# EAGLE design air_flow (EAGLE 9.5.2)
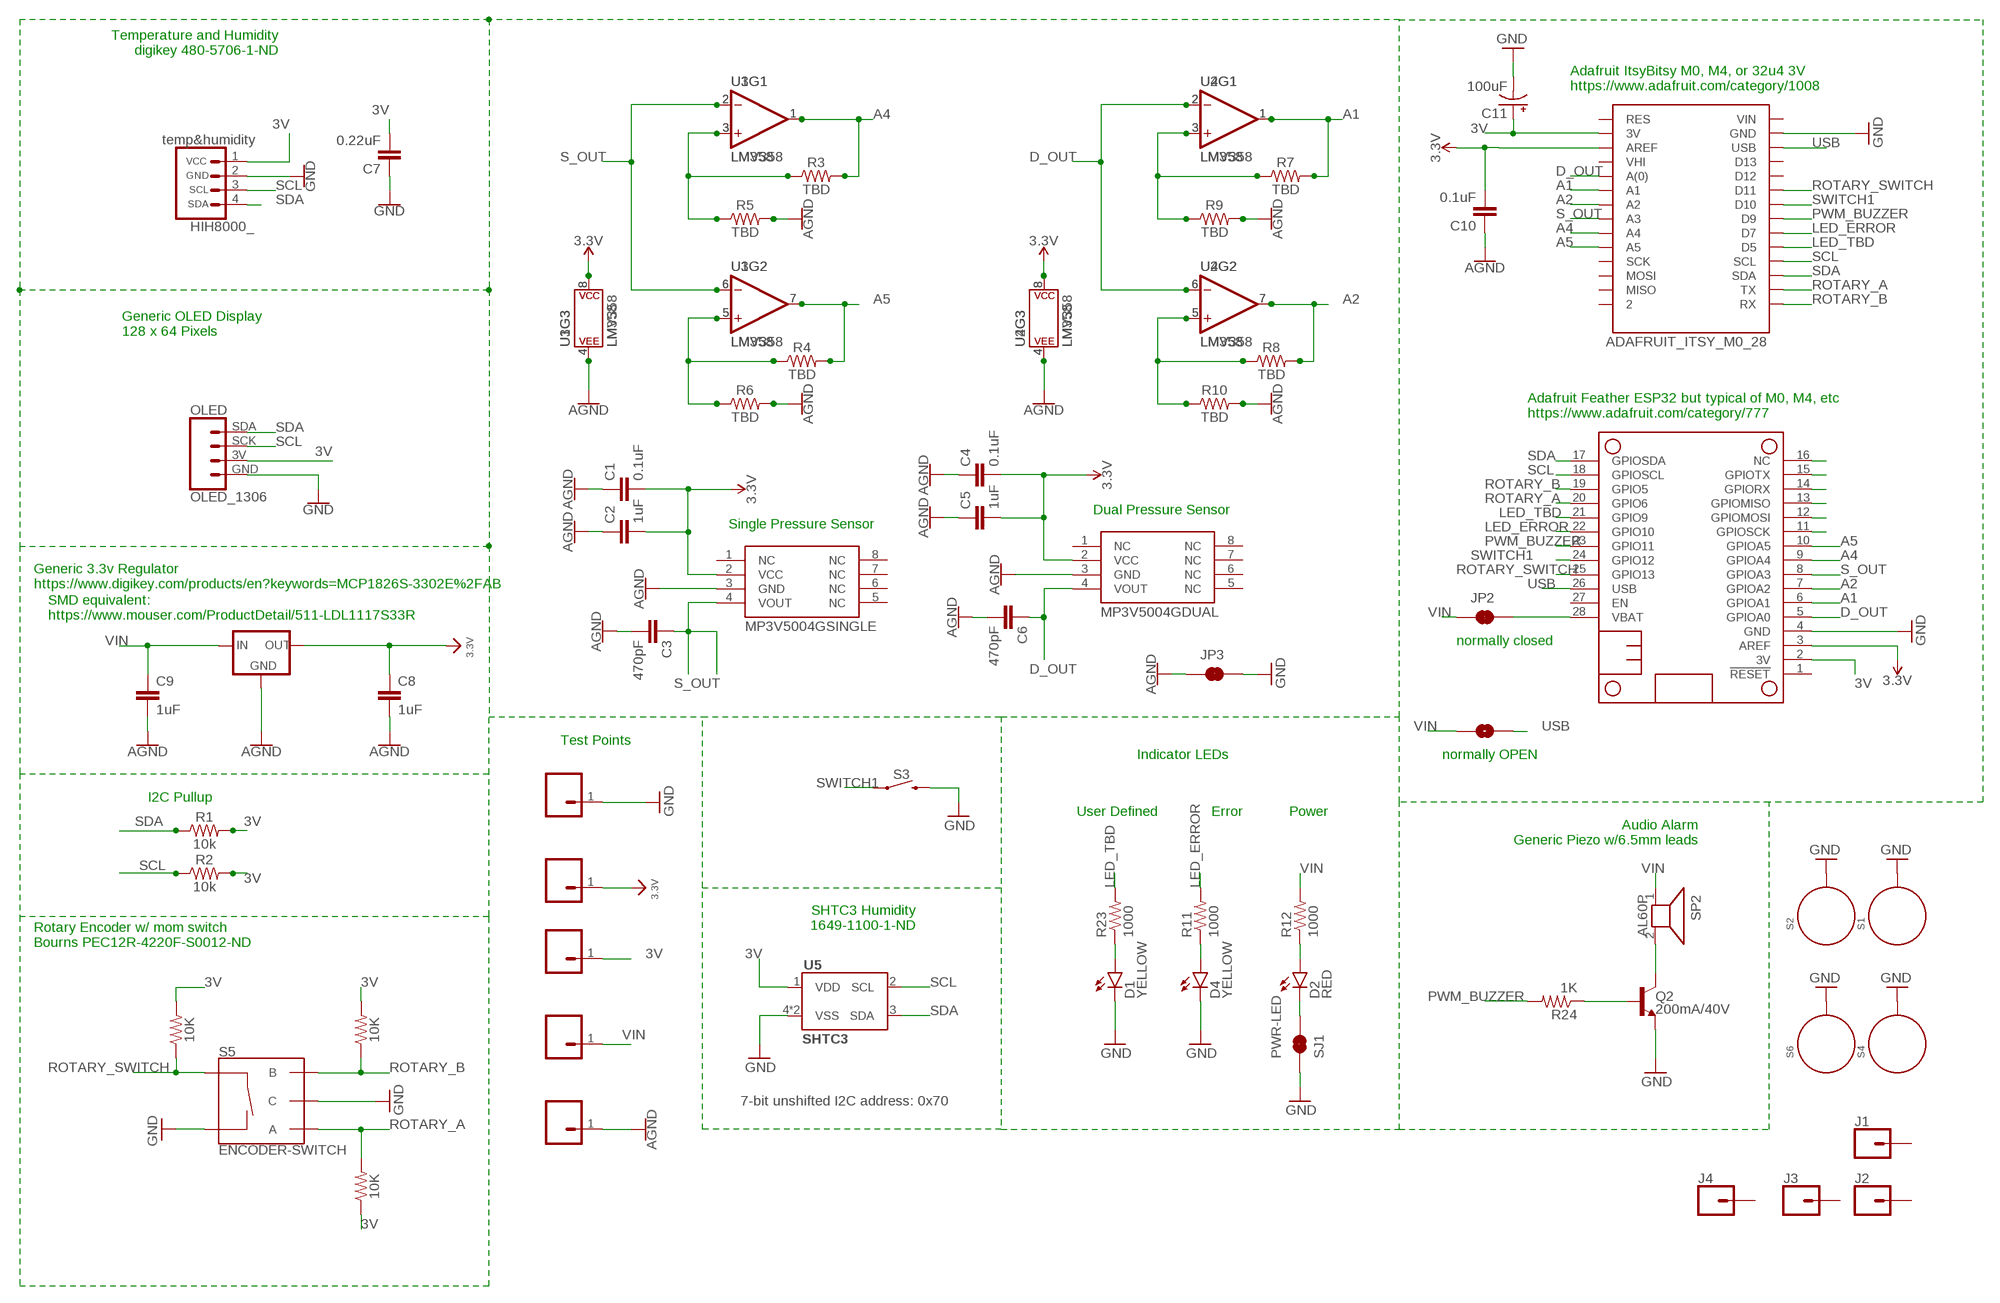
[diagram p0: schematic, sheet 1]

## Parts
3V_REGULATOR  LDL1117_5V_REG  [SOT223]
C1  0.1uF  0.1UF-KIT-EZ-50V-20%  [CAP-PTH-SMALL-KIT]
C2  1uF  0.1UF-KIT-EZ-50V-20%  [CAP-PTH-SMALL-KIT]
C3  470pF  0.1UF-KIT-EZ-50V-20%  [CAP-PTH-SMALL-KIT]
C4  0.1uF  0.1UF-KIT-EZ-50V-20%  [CAP-PTH-SMALL-KIT]
C5  1uF  0.1UF-KIT-EZ-50V-20%  [CAP-PTH-SMALL-KIT]
C6  470pF  0.1UF-KIT-EZ-50V-20%  [CAP-PTH-SMALL-KIT]
C7  0.22uF  0.1UF-KIT-EZ-50V-20%  [CAP-PTH-SMALL-KIT]
C8  1uF  0.1UF-KIT-EZ-50V-20%  [CAP-PTH-SMALL-KIT]
C9  1uF  0.1UF-KIT-EZ-50V-20%  [CAP-PTH-SMALL-KIT]
C10  0.1uF  0.1UF-KIT-EZ-50V-20%  [CAP-PTH-SMALL-KIT]
C11  100uF  100UF-POLAR-RADIAL-2.5MM-25V-20%  [CPOL-RADIAL-2.5MM-6.5MM]
D1  YELLOW  LED-YELLOWLARGE  [LED-1206]
D2  RED  LED-RED1206  [LED-1206]
D4  YELLOW  LED-YELLOWLARGE  [LED-1206]
J1  CONN_01  [1X01]
J2  CONN_01  [1X01]
J3  CONN_01  [1X01]
J4  CONN_01  [1X01]
JP1  JUMPER-SMT_2_NO_NO-SILK  [SMT-JUMPER_2_NO_NO-SILK]
JP2  JUMPER-SMT_2_NC_TRACE_SILK  [SMT-JUMPER_2_NC_TRACE_SILK]
JP3  JUMPER-SMT_2_NC_TRACE_SILK  [SMT-JUMPER_2_NC_TRACE_SILK]
MS2  FEATHERWING_NODIM  [FEATHERWING_DIM]
Q2  200mA/40V  TRANS_NPN-2N3904  [TO-92]
R1  10k  10KOHM-HORIZ-1/4W-5%  [AXIAL-0.3]
R2  10k  10KOHM-HORIZ-1/4W-5%  [AXIAL-0.3]
R3  TBD  10KOHM-HORIZ-1/4W-5%  [AXIAL-0.3]
R4  TBD  10KOHM-HORIZ-1/4W-5%  [AXIAL-0.3]
R5  TBD  10KOHM-HORIZ-1/4W-5%  [AXIAL-0.3]
R6  TBD  10KOHM-HORIZ-1/4W-5%  [AXIAL-0.3]
R7  TBD  10KOHM-HORIZ-1/4W-5%  [AXIAL-0.3]
R8  TBD  10KOHM-HORIZ-1/4W-5%  [AXIAL-0.3]
R9  TBD  10KOHM-HORIZ-1/4W-5%  [AXIAL-0.3]
R10  TBD  10KOHM-HORIZ-1/4W-5%  [AXIAL-0.3]
R11  1000  RESISTOR0805-RES  [0805]
R12  1000  RESISTOR0805-RES  [0805]
R13  0.3  0.3OHM-0805-1/8W-1%  [0805]
R14  0.3  0.3OHM-0805-1/8W-1%  [0805]
R15  0.3  0.3OHM-0805-1/8W-1%  [0805]
R16  0.3  0.3OHM-0805-1/8W-1%  [0805]
R17  0.3  0.3OHM-0805-1/8W-1%  [0805]
R18  0.3  0.3OHM-0805-1/8W-1%  [0805]
R19  0.3  0.3OHM-0805-1/8W-1%  [0805]
R20  0.3  0.3OHM-0805-1/8W-1%  [0805]
R21  0.3  0.3OHM-0805-1/8W-1%  [0805]
R22  0.3  0.3OHM-0805-1/8W-1%  [0805]
R23  1000  RESISTOR0805-RES  [0805]
R24  1K  RESISTOR0805-RES  [0805]
R26  10K  0.3OHM-0805-1/8W-1%  [0805]
R27  10K  0.3OHM-0805-1/8W-1%  [0805]
R28  10K  0.3OHM-0805-1/8W-1%  [0805]
S1  STANDOFF_ELECTRICAL5-32  [STANDOFF_ELECTRICAL_5_32]
S2  STANDOFF_ELECTRICAL5-32  [STANDOFF_ELECTRICAL_5_32]
S3  MOMENTARY-SWITCH-SPST-PTH-6.0MM-KIT  [TACTILE_SWITCH_PTH_6.0MM_KIT]
S4  STANDOFF_ELECTRICAL5-32  [STANDOFF_ELECTRICAL_5_32]
S5  ENCODER-SWITCH  [ROTARY_ENC_PLAIN]
S6  STANDOFF_ELECTRICAL5-32  [STANDOFF_ELECTRICAL_5_32]
SJ1  PWR-LED  JUMPER-PAD-2-NC_BY_TRACENO_SILK  [PAD-JUMPER-2-NC_BY_TRACE_NO_SILK]
SP2  AL60P  [AL60P]
U1  LM358  [DIP08]
U2  LM358  [DIP08]
U3  LMV358  LMV358SOIC  [SO08]
U4  LMV358  LMV358SOIC  [SO08]
U5  SHTC3  [SHTC3]
U$1  OLED_1306  [OLED_1306]
U$2  MP3V5004GSINGLE  [MP3V5004GP]
U$3  MP3V5004GDUAL  [MP3V5004DP]
U$4  HIH8000_  [HIH8120_TH]
U$20  CONN_0138MILL  [1X01-40MILL]
U$26  CONN_0138MILL  [1X01-40MILL]
U$31  CONN_0138MILL  [1X01-40MILL]
U$39  CONN_0138MILL  [1X01-40MILL]
U$40  CONN_0138MILL  [1X01-40MILL]
U$45  ADAFRUIT_ITSY_M0_28  [ADAFRUIT_ITS_MO_28]

## Nets
3.3V: 3V_REGULATOR.2(OUT) 3V_REGULATOR.4(OUT) C1.2 C2.2 C4.2 C5.2 C8.1 C10.2 MS2.3(AREF) U1.8(P$V+) U2.8(P$V+) U3.8(P$V+) U4.8(P$V+) U$2.2(VCC) U$3.2(VCC) U$39.1 U$45.AREF
3V: C7.2 C11.1(+) MS2.2(3V) R1.P$2 R2.P$2 R21.2 R22.2 R26.2 R27.1 R28.2 U5.1(VDD) U$1.3V(VCC) U$4.1(VCC) U$20.1 U$45.3V
A1: MS2.6(GPIOA1) R7.P$2 R17.2 U2.1(OUT) U4.1(OUT) U$45.A1
A2: MS2.7(GPIOA2) R8.P$2 R19.2 U2.7(OUT) U4.7(OUT) U$45.A2
A4: MS2.9(GPIOA4) R3.P$2 R16.2 U1.1(OUT) U3.1(OUT) U$45.A4
A5: MS2.10(GPIOA5) R4.P$2 R14.2 U1.7(OUT) U3.7(OUT) U$45.A5
AGND: 3V_REGULATOR.1(GND) C1.1 C2.1 C3.2 C4.1 C5.1 C6.2 C8.2 C9.2 C10.1 JP3.1 R5.P$2 R6.P$2 R9.P$2 R10.P$2 R13.2 R15.2 R18.2 R20.2 U1.4(P$V-) U2.4(P$V-) U3.4(P$V-) U4.4(P$V-) U$2.3(GND) U$3.3(GND) U$26.1
D_OUT: C6.1 MS2.5(GPIOA0) U2.2(-IN) U2.6(-IN) U4.2(-IN) U4.6(-IN) U$3.4(VOUT) U$45.A0(A(0))
GND: C7.1 C11.2(-) D1.C D4.C JP3.2 MS2.4(GND) Q2.1(E) S1.P1 S2.P1 S3.3 S4.P1 S5.C S5.SW- S6.P1 SJ1.1 U5.4(VSS) U5.5(VSS) U$1.GND U$4.2(GND) U$31.1 U$45.GND
LED_ERROR: MS2.22(GPIO10) R11.2 U$45.D7
LED_TBD: MS2.21(GPIO9) R23.2 U$45.D5
N$1: R3.P$1 R5.P$1 R13.1 R16.1 U1.3(+IN) U3.3(+IN)
N$2: D2.A R12.1
N$3: D1.A R23.1
N$5: R4.P$1 R6.P$1 R14.1 R15.1 U1.5(+IN) U3.5(+IN)
N$6: R7.P$1 R9.P$1 R17.1 R18.1 U2.3(+IN) U4.3(+IN)
N$7: MS2.16(NC)
N$8: R8.P$1 R10.P$1 R19.1 R20.1 U2.5(+IN) U4.5(+IN)
N$9: Q2.3(C) SP2.2
N$10: Q2.2(B) R24.1
N$11: D4.A R11.1
N$12: D2.C SJ1.2
N$13: MS2.15(GPIOTX)
N$14: MS2.14(GPIORX)
N$15: MS2.13(GPIOMISO)
N$16: MS2.12(GPIOMOSI)
N$17: MS2.11(GPIOSCK)
PWM_BUZZER: MS2.23(GPIO11) R24.2 U$45.D9
ROTARY_A: MS2.20(GPIO6) R27.2 S5.A U$45.TX
ROTARY_B: MS2.19(GPIO5) R26.1 S5.B U$45.RX
ROTARY_SWITCH: MS2.25(GPIO13) R28.1 S5.SW+ U$45.D11
S_OUT: C3.1 MS2.8(GPIOA3) U1.2(-IN) U1.6(-IN) U3.2(-IN) U3.6(-IN) U$2.4(VOUT) U$45.A3
SCL: MS2.18(GPIOSCL) R2.P$1 R22.1 U5.2(SCL) U$1.SCK U$4.3(SCL) U$45.SCL
SDA: MS2.17(GPIOSDA) R1.P$1 R21.1 U5.3(SDA) U$1.SDA U$4.4(SDA) U$45.SDA
SWITCH1: MS2.24(GPIO12) S3.1 U$45.D10
USB: JP1.2 MS2.26(USB) U$45.USB
VBAT: JP2.2 MS2.28(VBAT)
VIN: 3V_REGULATOR.3(IN) C9.1 JP1.1 JP2.1 R12.2 SP2.1 U$40.1
Unconnected: J1.1 J2.1 J3.1 J4.1 MS2.1(!RESET) MS2.27(EN) U$2.1(NC) U$2.5(NC) U$2.6(NC) U$2.7(NC) U$2.8(NC) U$3.1(NC) U$3.5(NC) U$3.6(NC) U$3.7(NC) U$3.8(NC) U$45.2 U$45.D12 U$45.D13 U$45.MISO U$45.MOSI U$45.RES U$45.SCK U$45.VHI U$45.VIN

## Notes on the sheet
- Temperature and Humidity
  digikey 480-5706-1-ND
- Adafruit ItsyBitsy M0, M4, or 32u4 3V
  https://www.adafruit.com/category/1008
- Generic OLED Display
  128 x 64 Pixels
- Adafruit Feather ESP32 but typical of M0, M4, etc
  https://www.adafruit.com/category/777
- Dual Pressure Sensor
- Single Pressure Sensor
- Generic 3.3v Regulator
  https://www.digikey.com/products/en?keywords=MCP1826S-3302E%2FAB
- SMD equivalent: 
  https://www.mouser.com/ProductDetail/511-LDL1117S33R
- normally closed
- Test Points
- Indicator LEDs | normally OPEN
- I2C Pullup
- User Defined | Error | Power
- Audio Alarm
  Generic Piezo w/6.5mm leads
- SHTC3 Humidity
  1649-1100-1-ND
- Rotary Encoder w/ mom switch
  Bourns PEC12R-4220F-S0012-ND
- 7-bit unshifted I2C address: 0x70

## Library data of the parts
3V_REGULATOR = th_libraries_2:LDL1117_5V_REG: STMicroelectronics LDL1117S50R https://www.mouser.com/datasheet/2/389/ldl1117-1156241.pdf Mouser#: 511-LDL1117S50R bought 100 for $18 on ~2/3/18 5V, 1.2amp
C1 C4 C10 = SparkFun-Capacitors:0.1UF: 0.1µF ceramic capacitors A capacitor is a passive two-terminal electrical component used to store electrical energy temporarily in an electric field.; PROD_ID: CAP-08370
C2 C3 C5-C9 = SparkFun-Capacitors:0.1UF: 0.1µF ceramic capacitors A capacitor is a passive two-terminal electrical component used to store electrical energy temporarily in an electric field.; PROD_ID: CAP-08370; VALUE: 0.1uF
C11 = SparkFun-Capacitors:100UF-POLAR: 100µF polarized capacitors A capacitor is a passive two-terminal electrical component used to store electrical energy temporarily in an electric field.; PROD_ID: CAP-08439
D1 D4 = SparkFun-LED:LED-YELLOW: Yellow SMD LEDs LilyPad 1206- DIO-09909 0603- DIO-09003 "SMART" means more efficient and expensive; PROD_ID: DIO-00820
D2 = SparkFun-LED:LED-RED: Assorted Red LEDs LilyPad 1206- DIO-09912 1206- DIO-00809 0603- DIO-00819 "SMART" means more efficient and expensive; PROD_ID: DIO-00809
J1-J4 = SparkFun-Connectors:CONN_01: Single connection point. Often used as Generic Header-pin footprint for 0.1 inch spaced/style header connections On any of the 0.1 inch spaced packages, you can populate with these: Break Away Headers - Straight <https://www.sparkfun.com/products/116> (PRT-00116) Break Away Male Headers - Right Angle <https://www.sparkfun.com/products/553> (PRT-00553) Female Headers <https://www.sparkfun.com/products/115> (PRT-00115) Break Away Headers - Machine Pin <https://www.sparkfun.com/products/117> (PRT-00117) Break Away Female Headers - Swiss Machine Pin <https://www.sparkfun.com/products/743> (PRT-00743) This device is also useful as a general connection point to wire up your design to another part of your project. Our various solder wires solder well into these plated through hole pads. Hook-Up Wire - Assortment (Stranded, 22 AWG) <https://www.sparkfun.com/products/11375> (PRT-11375) Hook-Up Wire - Assortment (Solid Core, 22 AWG) <https://www.sparkfun.com/products/11367> (PRT-11367) View the entire wire category on our website here <https://www.sparkfun.com/categories/141> Special notes: SMTSO-256-ET is a "flush mount" nut for a 4-40 screw. We mostly use this on specialty testbeds; it is a nice way to connect hardware to your PCB at an adjustable hieght. Also note, the SNAP packages are for using a snappable style connector. We sell a baggie of snaps and they are also used on two LilyPad designs: Snap Assortment - 30 pack (male and female) <https://www.sparkfun.com/products/11347> (DEV-11347) LilyPad Arduino SimpleSnap <https://www.sparkfun.com/products/10941> (DEV-10941) LilyPad SimpleSnap Protoboard <https://www.sparkfun.com/products/10940> (DEV-10940)
JP1 = SparkFun-Jumpers:JUMPER-SMT_2_NO: Normally open jumper This jumper has two pads in close proximity to each other. Apply solder to close the connection. Round pads are easier to solder for beginners, but are a lot larger. SparkFun Product that uses the round pads: SparkFun EL Sequencer <https://www.sparkfun.com/products/12781>
JP2 JP3 = SparkFun-Jumpers:JUMPER-SMT_2_NC_TRACE: Normally closed trace jumper This jumper has a trace between two pads so it's normally closed (NC). Use a razor knife to open the connection. For best results follow the IPC guidelines for cutting traces: Cutout at least 0.063 mm (0.005 in). Remove all loose material to clean up the cut area. Seal the cut with an approved epoxy. Reapply solder to reclose the connection.
MS2 = th_libraries:FEATHERWING
Q2 = SparkFun-DiscreteSemi:TRANS_NPN: NPN transistor Current controlled devices typically used to amplify current or used as a switch. BC547 - COM-08928 <http://www.sparkfun.com/products/8928> (TO-92 45V 100mA) (1.Collector 2.Base 3.Emitter) 2N3904 - COM-00521 <http://www.sparkfun.com/products/521> (TO-92 40V 200mA) (1.Emitter 2.Base 3.Collector) P2N2222A - COM-12852 <http://www.sparkfun.com/products/12852> (TO-92 40V 600mA) (1.Collector 2.Base 3.Emitter); PROD_ID: TRANS-08447
R1 R2 = SparkFun-Resistors:10KOHM: 10kΩ resistor A resistor is a passive two-terminal electrical component that implements electrical resistance as a circuit element. Resistors act to reduce current flow, and, at the same time, act to lower voltage levels within circuits. - Wikipedia; PROD_ID: RES-09435
R3-R10 = SparkFun-Resistors:10KOHM: 10kΩ resistor A resistor is a passive two-terminal electrical component that implements electrical resistance as a circuit element. Resistors act to reduce current flow, and, at the same time, act to lower voltage levels within circuits. - Wikipedia; PROD_ID: RES-09435; VALUE: 10k
R11 R12 R23 R24 = SparkFun-Passives:RESISTOR: Resistor Basic schematic elements and footprints for 0603, 1206, and PTH resistors.
R13-R22 = SparkFun-Resistors:0.3OHM: 0.3Ω resistor A resistor is a passive two-terminal electrical component that implements electrical resistance as a circuit element. Resistors act to reduce current flow, and, at the same time, act to lower voltage levels within circuits. - Wikipedia; PROD_ID: RES-11622
R26-R28 = SparkFun-Resistors:0.3OHM: 0.3Ω resistor A resistor is a passive two-terminal electrical component that implements electrical resistance as a circuit element. Resistors act to reduce current flow, and, at the same time, act to lower voltage levels within circuits. - Wikipedia; PROD_ID: RES-11622; VALUE: 0.3
S1 S2 S4 S6 = th_libraries:STANDOFF_ELECTRICAL: A standoff intended to be an electrically connected point. Pad size and stop size allow for a #8 Phillips pan screw head to make a solid connection to the board. Added 144mill drill hole that fits my normal wood screw
S3 = SparkFun-Switches:MOMENTARY-SWITCH-SPST: Momentary Switch (Pushbutton) - SPST Normally-open (NO) SPST momentary switches (buttons, pushbuttons). Variants PTH-12MM - 12mm square, through-hole Momentary Pushbutton Switch - 12mm Square <https://www.sparkfun.com/products/9190> (COM-09190) PTH-6.0MM, PTH-6.0MM-KIT - 6.0mm square, through-hole Mini Pushbutton Switch <https://www.sparkfun.com/products/97> (COM-00097) KIT package intended for soldering kit's - only one side of pads' copper is exposed. PTH-RIGHT-ANGLE-KIT - Right-angle, through-hole Right Angle Tactile Button <https://www.sparkfun.com/products/10791> - Used on SparkFun BigTime Watch Kit <https://www.sparkfun.com/products/11734> SMD-12MM - 12mm square, surface-mount Tactile Button - SMD (12mm) <https://www.sparkfun.com/products/12993> (COM-12993) Used on SparkFun PicoBoard <https://www.sparkfun.com/products/11888> SMD-4.5MM - 4.5mm Square Trackball Switch Used on SparkFun Blackberry Trackballer Breakout <https://www.sparkfun.com/products/13169> SMD-4.6MMX2.8MM - 4.60mm x 2.80mm, surface mount Used on SparkFun SAMD21 Mini Breakout <https://www.sparkfun.com/products/13664> SMD-5.2MM, SMD-5.2-REDUNDANT - 5.2mm square, surface-mount Mini Pushbutton Switch - SMD <https://www.sparkfun.com/products/8720> (COM-08720) Used on Arduino Pro Mini <https://www.sparkfun.com/products/11114> REDUNDANT package connects both switch circuits together SMD-6.0X3.5MM - 6.0 x 3.5mm, surface mount Momentary Reset Switch SMD <https://www.sparkfun.com/products/8229> (COM-08229) SMD-6.2MM-TALL - 6.2mm square, surface mount Tactile Button - SMD (6mm) <https://www.sparkfun.com/products/12992> Used on SparkFun Digital Sandbox <https://www.sparkfun.com/products/12651> SMD-RIGHT-ANGLE - Right-angle, surface mount Used on SparkFun Block for Intel® Edison - Arduino <https://www.sparkfun.com/products/13036>; PROD_ID: SWCH-08441; SF_SKU: COM-00097
S5 = SparkFun-Switches:ENCODER-SWITCH: Rotary Encoder w/ Select Switch Encoders rotate similarly to potentiometers, but they’re different from potentiometers in that an encoder has full rotation without limits. They output gray code so that you can tell how much and in which direction the encoder has been turned. This encoder includes a push-down select switch built into the shaft. SparkFun Products Rotary Encoder <https://www.sparkfun.com/products/9117> (COM-09117); SF_SKU: COM-09117
SJ1 = SparkFun-Passives:JUMPER-PAD-2-NC_BY_TRACE
SP2 = buzzer:AL60P: SPEAKER Source: Buerklin; OC_FARNELL: unknown; OC_NEWARK: unknown
U1 U2 = SparkFun-IC-Amplifiers:LM358: LM358 Jellybean op-amp Datasheet <http://www.sparkfun.com/datasheets/Components/General/LM358.pdf> SparkFun Products Op-Amp (Thru-Hole) - LM358 <https://www.sparkfun.com/products/9456> (COM-09456); PROD_ID: IC-09172
U3 U4 = SparkFun-IC-Amplifiers:LMV358: IC LMV358 DUAL OP AMP Jellybean rail-to-rail output op-amp SparkFun Products SparkFun PicoBoard <https://www.sparkfun.com/products/11888> (WIG-11888) SparkFun Vernier Interface Shield <https://www.sparkfun.com/products/12858> (DEV-12858) SparkFun Blynk Board - ESP8266 <https://www.sparkfun.com/products/13794> (WRL-13794) SparkFun Digital Sandbox <https://www.sparkfun.com/products/12651> (DEV-12651 RoHS); PROD_ID: IC-09657
U5 = SHTC3:SHTC3
U$1 = air_flow:OLED_1306
U$2 U$3 = air_flow_2:MP3V5004G: https://www.nxp.com/docs/en/data-sheet/MP3V5004G.pdf
U$4 = air_flow_2:HIH8000_: https://sensing.honeywell.com/index.php?ci_id=147072 https://www.digikey.com/product-detail/en/HIH8120-021-001/480-5706-1-ND
U$20 U$26 U$31 U$39 U$40 = th_libraries3:CONN_01
U$45 = easy_bee_counter:ADAFRUIT_ITSY_M0_28

## Net classes
1 highpower: width 0.305 mm, drill 0.483 mm
2 lowpower: width 0.305 mm, drill 0.483 mm

## Board
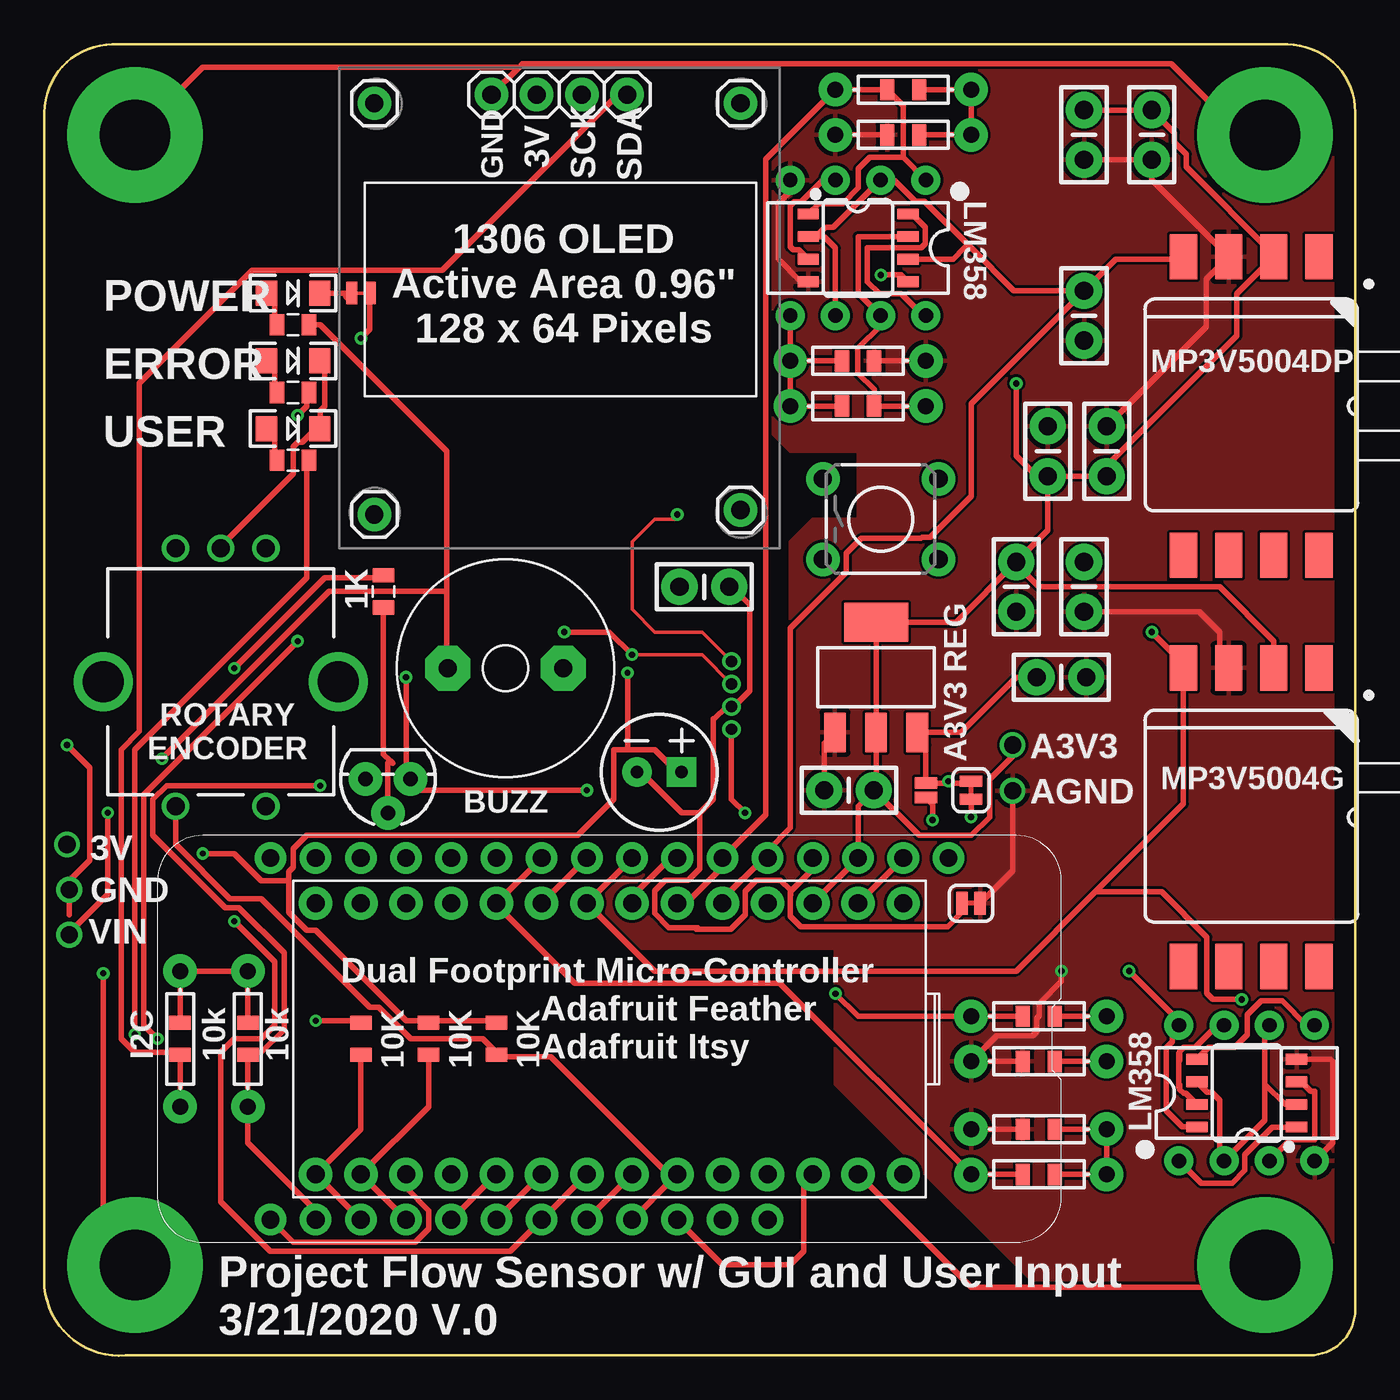
[diagram p1: board, top side]
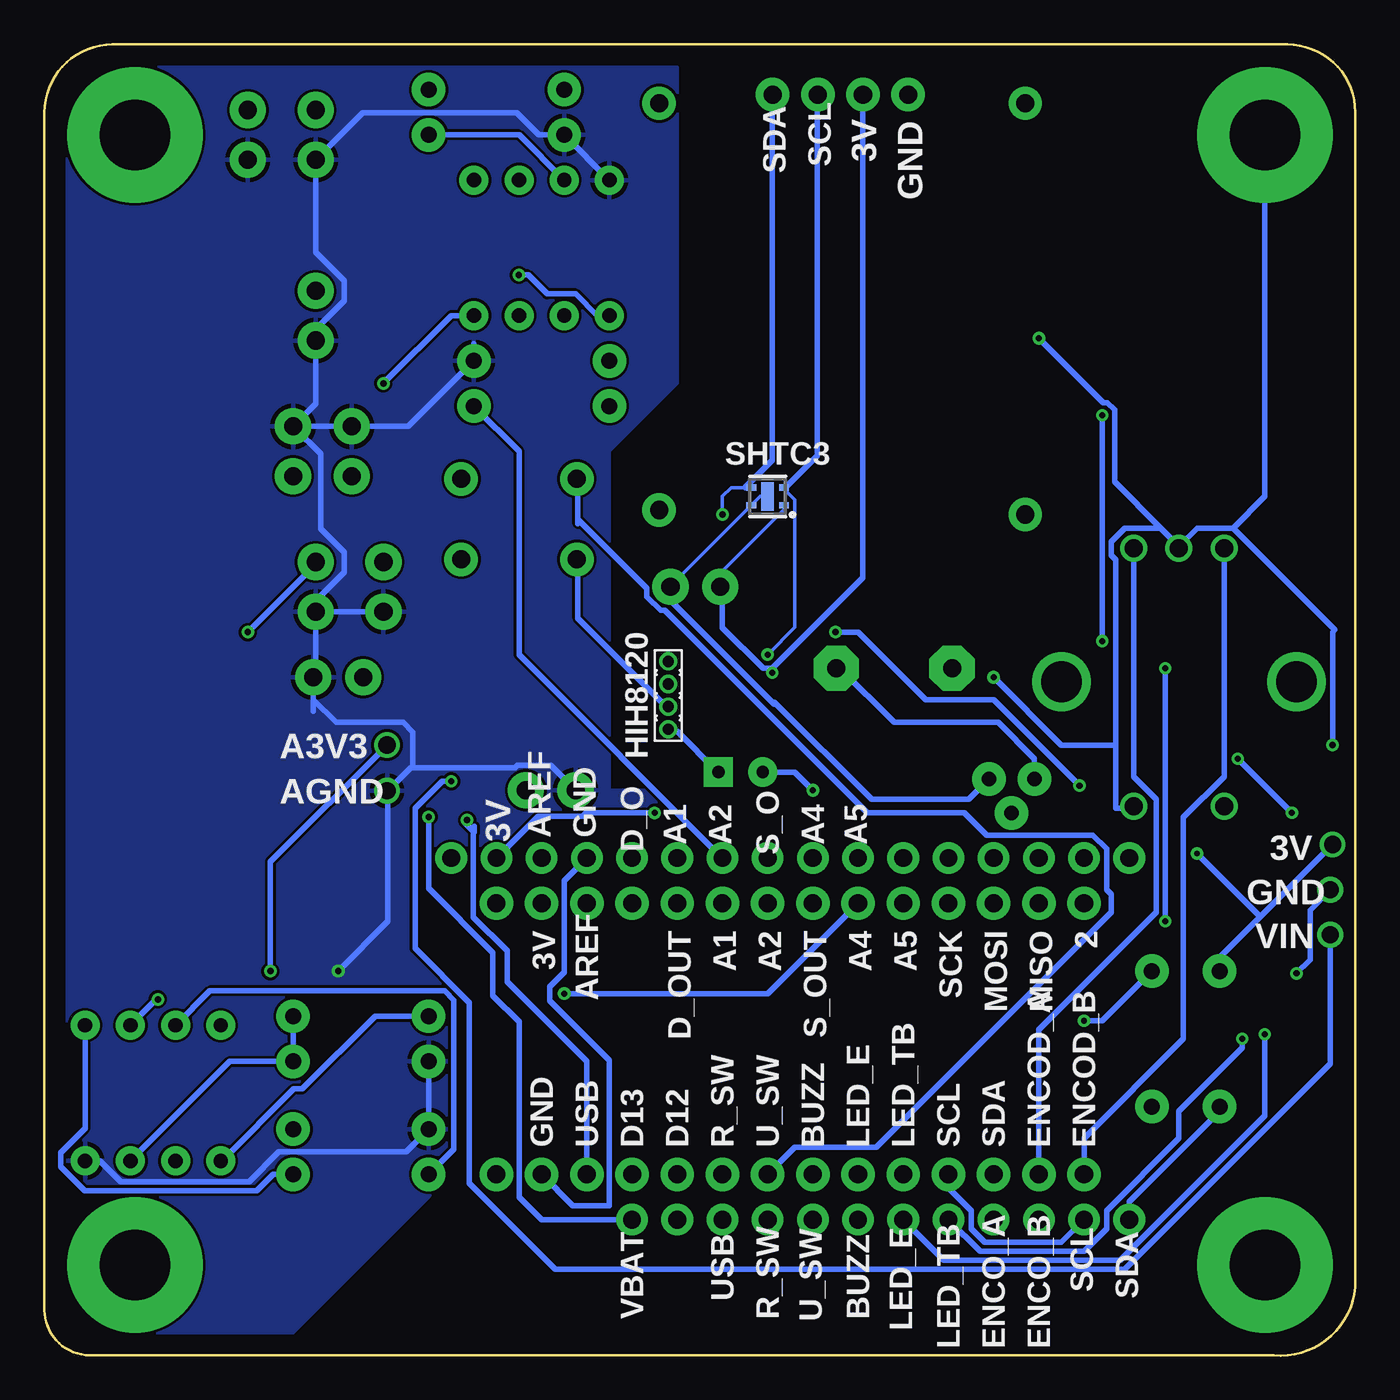
[diagram p2: board, bottom side, seen from below]

Size 73.66 x 73.68 mm. Coordinates in mm from the lower left corner, seen from the top.
Outline: 71.12,0.02 4.57,0.02 arc-90 0,3.83 0,69.87 arc-90 3.81,73.68 69.85,73.68 arc-90 73.66,69.87 73.66,2.56 arc-90 71.12,0.02
Copper layers (1*16): Top 0.0356mm / dielectric 1.5011mm / Bottom 0.0356mm
Design rules "LaenPCBOrder *": minimum track width 12mil, minimum drill 13mil, track to track 6mil, track to pad 6mil, pad to pad 6mil, via to via 6mil, smd to smd 6mil, copper to edge 15mil, drill to drill 6mil, minimum pad ring 7mil, minimum via ring 7mil, stop-mask expansion 3mil, vias tented up to drill 25mil, thermal gap 10mil

### Footprints (pad centres in the part's own frame; a part is rotated, then mirrored left to right if it is on the bottom)
SOT223 = smd 1.219 x 2.235: 1 -2.311,-3.099; 2 0,-3.099; 3 2.311,-3.099 | smd 3.6 x 2.2: 4 0,3.099
CAP-PTH-SMALL-KIT = drill 1.016 pad 2.032: 1 -1.397,0; 2 1.397,0
CPOL-RADIAL-2.5MM-6.5MM = drill 0.7 pad 1.651 square: 1 1.25,0 | drill 0.7 pad 1.651: 2 -1.25,0
LED-1206 = smd 1.2 x 1.4: A -1.5,0; C 1.5,0
1X01 = drill 1.016 pad 1.88: 1 0,0
SMT-JUMPER_2_NO_NO-SILK = smd 0.635 x 1.27: 1 -0.406,0; 2 0.406,0
SMT-JUMPER_2_NC_TRACE_SILK = smd 0.635 x 1.27: 1 -0.508,0; 2 0.508,0
FEATHERWING_DIM = drill 1 pad 1.778: 1 6.35,1.27; 2 8.89,1.27; 3 11.43,1.27; 4 13.97,1.27; 5 16.51,1.27; 6 19.05,1.27; 7 21.59,1.27; 8 24.13,1.27; 9 26.67,1.27; 10 29.21,1.27; 11 31.75,1.27; 12 34.29,1.27; 13 36.83,1.27; 14 39.37,1.27; 15 41.91,1.27; 16 44.45,1.27; 17 44.45,21.59; 18 41.91,21.59; 19 39.37,21.59; 20 36.83,21.59; 21 34.29,21.59; 22 31.75,21.59; 23 29.21,21.59; 24 26.67,21.59; 25 24.13,21.59; 26 21.59,21.59; 27 19.05,21.59; 28 16.51,21.59
TO-92 = drill 0.813 pad 1.88: 1 -1.27,0; 2 0,1.905; 3 1.27,0
AXIAL-0.3 = drill 0.9 pad 1.88: P$1 -3.81,0; P$2 3.81,0
0805 = smd 0.8 x 1.2: 1 -0.9,0; 2 0.9,0
STANDOFF_ELECTRICAL_5_32 = drill 3.969 pad 7.62: P1 0,0
TACTILE_SWITCH_PTH_6.0MM_KIT = drill 1.016 pad 1.88: 1 -3.251,2.261; 2 3.251,2.261; 3 -3.251,-2.261; 4 3.251,-2.261
ROTARY_ENC_PLAIN = drill 1.016: A 7.493,-2.54; B 7.493,2.54; C 7.493,0; SW+ -6.985,2.54; SW- -6.985,-2.54 | drill 2.286: P$3 0,6.604; P$4 0,-6.604
PAD-JUMPER-2-NC_BY_TRACE_NO_SILK = smd 0.635 x 1.27: 1 -0.508,0; 2 0.508,0
AL60P = drill 1.016 pad 2.54 octagon: 1 -3.251,0; 2 3.251,0
DIP08 = drill 0.813 pad 1.626: 1 -3.81,-3.81; 2 -1.27,-3.81; 3 1.27,-3.81; 4 3.81,-3.81; 5 3.81,3.81; 6 1.27,3.81; 7 -1.27,3.81; 8 -3.81,3.81
SO08 = smd 0.6 x 1.2: 1 -1.905,-2.8; 2 -0.635,-2.8; 3 0.635,-2.8; 4 1.905,-2.8; 5 1.905,2.8; 6 0.635,2.8; 7 -0.635,2.8; 8 -1.905,2.8
SHTC3 = smd 0.55 x 0.35: 1 -0.925,0.5; 2 -0.925,-0.5; 3 0.925,-0.5; 4 0.925,0.5 | smd 0.7 x 1.6: 5 0,0
OLED_1306 = drill 1.016 pad 1.88: 3V 11.15,-1.55; GND 8.61,-1.55; SCK 13.69,-1.55; SDA 16.23,-1.55
MP3V5004GP = smd 2.54 x 1.524: 1 -8.388,3.81; 2 -8.388,1.27; 3 -8.388,-1.27; 4 -8.388,-3.81; 5 8.388,-3.81; 6 8.388,-1.27; 7 8.388,1.27; 8 8.388,3.81
MP3V5004DP = smd 2.54 x 1.524: 1 -8.388,3.81; 2 -8.388,1.27; 3 -8.388,-1.27; 4 -8.388,-3.81; 5 8.388,-3.81; 6 8.388,-1.27; 7 8.388,1.27; 8 8.388,3.81
HIH8120_TH = drill 0.635 pad 1.016: 1 -1.905,0; 2 -0.635,0; 3 0.635,0; 4 1.905,0
1X01-40MILL = drill 0.965 pad 1.397: 1 0,0
ADAFRUIT_ITS_MO_28 = drill 1.016 pad 1.88: 2 -7.62,-8.89; 3V -7.62,21.59; A0 -7.62,13.97; A1 -7.62,11.43; A2 -7.62,8.89; A3 -7.62,6.35; A4 -7.62,3.81; A5 -7.62,1.27; AREF -7.62,19.05; D5 7.62,1.27; D7 7.62,3.81; D9 7.62,6.35; D10 7.62,8.89; D11 7.62,11.43; D12 7.62,13.97; D13 7.62,16.51; GND 7.62,21.59; MISO -7.62,-6.35; MOSI -7.62,-3.81; RES -7.62,24.13; RX 7.62,-8.89; SCK -7.62,-1.27; SCL 7.62,-1.27; SDA 7.62,-3.81; TX 7.62,-6.35; USB 7.62,19.05; VHI -7.62,16.51; VIN 7.62,24.13

### Placement (x,y rotation side)
3V_REGULATOR  46.74,38.12 0 top
C1  59.69,50.82 270 top
C2  56.39,50.82 270 top
C3  58.42,43.2 270 top
C4  62.23,68.6 90 top
C5  58.42,68.6 90 top
C6  58.42,58.44 270 top
C7  37.08,43.2 180 top
C8  54.61,43.2 270 top
C9  57.15,38.12 0 top
C10  45.21,31.77 0 top
C11  34.54,32.78 0 top
D1  13.97,55.9 0 top
D2  13.97,59.71 0 top
D4  13.97,52.09 0 top
J1  18.54,47.26 0 top
J2  39.12,47.52 0 top
J3  39.12,70.38 0 top
J4  18.54,70.38 0 top
JP1  49.53,31.77 270 top
JP2  52.07,31.77 270 top
JP3  52.07,25.42 180 top
MS2  57.15,29.23 180 top
Q2  19.3,32.4 180 top
R1  7.62,17.8 90 top
R2  11.43,17.8 90 top
R3  55.88,19.07 180 top
R4  55.88,10.18 180 top
R5  55.88,16.53 180 top
R6  55.88,12.72 180 top
R7  48.26,71.14 180 top
R8  45.72,53.36 0 top
R9  48.26,68.6 180 top
R10  45.72,55.9 0 top
R11  13.97,50.31 0 top
R12  13.97,57.93 0 top
R13  55.88,16.53 180 top
R14  55.88,10.18 180 top
R15  55.88,12.72 180 top
R16  55.88,19.07 180 top
R17  48.26,71.14 180 top
R18  48.26,68.6 180 top
R19  45.72,53.36 0 top
R20  45.72,55.9 0 top
R21  7.62,17.8 90 top
R22  11.43,17.8 90 top
R23  13.97,54.12 0 top
R24  19.05,42.94 90 top
R26  17.78,17.8 90 top
R27  21.59,17.8 270 top
R28  25.4,17.8 90 top
S1  5.08,68.6 0 top
S2  5.08,5.1 0 top
S3  46.99,47.01 0 top
S4  68.58,68.6 0 top
S5  9.91,37.86 90 top
S6  68.58,5.1 0 top
SJ1  17.78,59.71 180 top
SP2  25.91,38.63 0 top
U1  67.56,14.75 0 top
U2  45.72,62.25 180 top
U3  67.56,14.75 90 top
U4  45.72,62.25 270 top
U5  33.02,48.28 180 bottom
U$1  16.51,72.41 0 top
U$2  67.82,30.25 270 top
U$3  67.82,53.36 270 top
U$4  38.61,37.1 90 bottom
U$20  1.27,28.72 270 top
U$26  54.41,31.74 0 top
U$31  1.4,26.18 270 top
U$39  54.41,34.31 270 top
U$40  1.4,23.64 270 top
U$45  24.13,17.8 270 top

### Tracks (layer width: path | path; a pad name or v marks a point on that pad's centre or on a via)
3.3V  (via drill 0.35)
  Top 0.305: U$2.2 69.09,40.15 66.04,43.2 55.88,43.2 54.61,44.47 C8.1 | C5.2 C4.2 63.5,68.72 63.5,68.18 64.17,67.51 64.17,66.79 69.09,61.87 U$3.2 67,59.66 67,57.31 59.69,49.99 C1.2 C2.2 56.39,49.29 | U$45.AREF MS2.3 45.72,30.88 C10.2 | C8.1 51.23,41.22 3V_REGULATOR.4 3V_REGULATOR.2 46.74,31.89 C10.2 | C8.1 56.39,46.37 56.39,49.29 | U4.8 48.75,64.15 49.5,63.4 49.5,62.48 49.26,62.24 46.24,62.24 46.24,60.35 46.93,59.66 48.15,59.66 49.38,58.44 U2.8 | 56.39,49.29 56.13,49.04 54.61,50.56 v54.61,54.63 | U3.8 63.94,12.84 63.04,13.74 63.04,17.29 63.37,17.62 63.37,18.18 U1.8 63.75,18.81 v60.96,21.61 | C10.2 49.15,29.23 52.09,29.23 53.12,30.26 53.12,32.4 54.41,33.68 U$39.1
  Bottom 0.305: U2.8 50.8,58.44 v54.61,54.63 | U$39.1 60.96,27.75 v60.96,21.61
3V  (via drill 0.33, 0.35)
  Top 0.305: U$45.3V MS2.2 | v39.37,30.5 38.61,31.26 U$4.1 | R22.2 R2.P$2 R1.P$2 R21.2 | v15.24,18.81 17.78,18.81 R26.2 | 21.59,18.81 25.4,18.81 R28.2 | 21.59,18.81 20.32,18.81 15.24,23.89 14.73,23.89 13.72,24.91 13.72,26.69 | 13.72,26.69 13.72,27.2 13.97,27.45 13.97,28.47 14.73,29.23 29.97,29.23 32,31.26 32,34.05 32.77,34.05 | 32.77,34.05 34.29,34.05 35.56,32.78 C11.1 | 21.59,18.81 R27.1 | v8.89,28.21 10.67,28.21 12.19,26.69 13.72,26.69 | 32.77,34.05 v32.77,38.37
  Bottom 0.203: U5.1 32.09,47.55 32.24,47.41 32.24,47.42 35.69,43.97 C7.2
  Bottom 0.305: v39.37,30.5 43.22,30.5 43.42,30.29 45.92,30.29 MS2.2 | 32.77,38.63 27.69,43.71 27.69,70.63 U$1.3V | 32.77,38.63 33.27,38.63 35.56,40.91 35.56,43.2 C7.2 | v15.24,18.81 14.22,18.81 R2.P$2 | 5.33,24.66 7.62,22.37 R1.P$2 | 5.33,24.66 U$20.1 | U$4.1 38.61,35.07 38.1,35.07 35.81,32.78 C11.1 | v8.89,28.21 5.33,24.66 | v32.77,38.37 32.77,38.63
A1
  Top 0.305: U$45.A1 36.07,25.42 38.1,27.45 MS2.6 40.54,30.4 40.54,67.23 R7.P$2 R17.2 48.26,70.24 48.26,67.33 | U2.1 48.26,67.33 | U4.1 43.5,64.74 44.86,64.74 45.75,65.62 45.75,66.7 46.38,67.33 48.26,67.33
A2
  Top 0.305: U$45.A2 33.02,25.8 35.18,27.96 MS2.7 | U4.7 45.72,62.88 45.72,59.71 U2.7 46.99,57.88 45.71,56.6 45.71,55.2 46.62,54.29 R19.2 R8.P$2
  Bottom 0.305: MS2.7 46.99,39.39 46.99,50.82 R8.P$2
A4  (via drill 0.35)
  Top 0.305: U$45.A4 MS2.9 | R16.2 R3.P$2 45.72,19.07 v44.45,20.34 | U3.1 70.24,12.84 70.22,12.82 69.01,12.82 67.46,11.28 67.46,10.4 66.76,9.69 65,9.69 U1.1
  Bottom 0.305: U1.1 63.68,10.94 59.64,14.98 59.17,14.98 55.09,19.07 R3.P$2 | v44.45,20.34 33.02,20.34 U$45.A4
A5
  Top 0.305: MS2.10 U$45.A5 25.4,25.33 29.81,20.92 41.33,20.92 R4.P$2 R14.2 | U1.7 65.91,18.56 64.66,17.31 64.02,17.31 63.81,17.1 63.81,16.58 63.75,16.53 | 63.75,15.06 63.75,15.26 | 63.75,15.26 63.75,16.53 | 63.75,16.53 63.75,16.98 | 63.75,15.26 63.81,15.2 63.81,14.94 64.02,14.73 64.15,14.73 U3.7
  Bottom 0.305: R4.P$2 50.65,11.6 50.65,19.96 51.17,20.49 64.36,20.49 U1.7
AGND  (via drill 0.35)
  Top 0.305: U$2.3 66.04,39.15 66.04,40.66 64.9,41.8 C3.2 58.55,41.67 | C5.1 C4.1 62.23,66.06 U$3.3 65.28,60.48 65.28,57.8 C1.1 | C10.1 43.81,34.41 3V_REGULATOR.1 | JP3.1 54.41,27.25 U$26.1 | R18.2 R9.P$2 | R20.2 R10.P$2 | U4.4 42.51,60.34 41.22,61.63 41.22,64.75 41.91,65.43 U2.4 | R15.2 R6.P$2 | R13.2 R5.P$2 53.5,17.96 55.53,17.96 55.76,18.19 55.76,18.95 55.9,19.08 55.9,19.77 57.15,21.02 v57.15,21.61 | U3.4 72.26,16.65 72.39,16.53 72.39,11.96 U1.4
  Bottom 0.305: 58.55,36.21 58.55,36.85 | 58.55,36.85 C9.2 58.42,38.24 C3.2 | C3.2 58.42,42.42 56.82,44.02 56.82,45.14 58.14,46.46 58.14,50.67 59.63,52.15 | 59.63,52.15 C1.1 58.42,53.48 C6.2 58.42,57.66 56.82,59.26 56.82,60.41 58.42,62.01 C5.1 55.78,69.84 47.13,69.84 45.89,68.6 R9.P$2 U2.4 | 59.63,52.15 59.56,52.21 C2.1 53.21,52.21 R10.P$2 49.53,56.86 | U1.4 70.54,10.94 69.37,9.77 62.16,9.77 60.48,11.45 53.34,11.45 R6.P$2 R5.P$2 | v57.15,21.61 54.36,24.4 54.36,31.79 U$26.1 54.37,31.74 53.07,33.04 52.97,33.04 | 58.55,36.85 57.28,35.58 53.51,35.58 52.97,35.04 52.97,33.04 | 52.97,33.04 47.21,33.04 47.08,33.16 45.21,33.16 C10.1 | C3.2 C8.2
  pour Top (isolate 0): 71.12,72.41 38.1,72.41 38.1,54.63 41.91,50.82 45.72,50.82 45.72,47.01 43.18,47.01 41.91,45.74 41.91,31.77 40.64,30.5 26.67,30.5 24.13,27.96 24.13,22.88 44.45,22.88 44.45,15.26 58.42,1.29 72.39,1.29 72.39,71.14
  pour Bottom (isolate 0): 71.12,72.41 38.1,72.41 38.1,54.63 41.91,50.82 41.91,31.77 39.37,31.77 37.85,30.24 25.15,30.24 24.13,29.23 24.13,22.88 44.45,22.88 44.45,16.53 59.69,1.29 72.39,1.29 72.39,71.14
D_OUT
  Top 0.305: U$3.4 63.88,61.61 60.2,61.61 C6.1 | U$45.A0 38.1,25.65 40.41,27.96 MS2.5 40.64,28.38 41.91,29.65 41.91,40.88 45.06,44.03 45.06,45.08 45.9,45.92 49.24,45.92 49.32,45.99 49.78,45.99 52.07,48.28 52.07,53.48 C6.1 | C6.1 54.48,59.83 52.07,62.25 | 52.07,62.25 51.7,62.25 51.06,61.61 U4.6 | 52.07,62.25 49.45,64.86 48.94,64.86 47.75,66.06 U2.2 44.32,63.4 43.87,63.4 43.35,62.88 U4.2 43.81,62.88 44.45,62.25 U2.6
GND  (via drill 0.35)
  Top 0.305: MS2.4 43.18,27.33 41.94,26.09 41.94,25.88 41.91,25.91 | JP3.2 51.56,24.91 50.75,24.1 42.49,24.1 41.91,24.67 41.91,25.91 | S4.P1 67.31,68.6 63.32,72.59 26.85,72.59 26.67,72.41 | 26.67,72.41 U$1.GND | S1.P1 8.89,72.41 26.67,72.41 | S6.P1 67.31,3.83 52.07,3.83 U$45.GND | 41.91,25.91 41.91,26.16 41.36,26.71 40,26.71 39.37,26.09 39.37,24.77 38.56,23.96 36.63,23.96 36.71,24.05 35.09,24.05 34.29,24.85 34.29,26.11 34.89,26.71 36.18,26.71 36.83,27.36 36.83,30.5 | 36.83,30.5 37.59,31.26 37.59,35.78 37.62,35.76 38.33,36.47 U$4.2 38.61,36.59 38.86,36.59 39.62,37.36 39.62,42.18 38.61,43.2 C7.1 | 1.4,24.78 U$31.1 1.4,26.69 2.54,27.83 2.54,33.04 v1.27,34.31 | 36.83,30.5 35.81,30.5 33.53,32.78 C11.2 | D1.C 15.49,55.9 15.75,55.64 15.75,53.36 15.49,53.1 15.49,52.09 D4.C 15.24,52.09 14.48,51.33 14.22,51.33 13.97,51.07 13.97,49.55 9.91,45.48 S5.C | S2.P1 3.3,6.88 v3.3,21.48 | SJ1.1 18.29,57.68 v17.78,57.17 | v30.48,31.77 21.21,31.77 Q2.1 20.32,32.66 v20.32,38.12
  Bottom 0.203: C7.1 38.48,43.24 U5.4 33.45,48.28 U5.5
  Bottom 0.305: MS2.4 44.45,26.69 44.45,21.55 45.26,20.74 45.26,19.94 41.91,16.59 41.91,8.42 43.97,8.42 U$45.GND | S3.3 43.69,44.72 43.69,41.42 38.61,36.34 U$4.2 | S5.SW- 12.45,30.75 13.46,30.75 13.46,34.31 | 13.46,34.31 13.46,44.72 13.72,44.98 13.72,45.74 12.95,46.5 10.92,46.5 | 9.91,45.48 10.92,46.5 | C7.1 38.35,43.2 38.35,42.31 32.64,36.59 32.64,36.72 27.18,31.26 21.72,31.26 Q2.1 | 6.86,46.5 1.14,40.78 1.27,40.66 v1.27,34.31 | 6.86,46.5 8.89,46.5 9.91,45.48 | 9.91,45.48 S5.C | S1.P1 5.08,48.28 6.86,46.5 | v3.3,21.48 2.54,22.24 2.54,25.04 U$31.1 | 10.92,46.5 13.53,49.1 13.53,53.14 13.94,53.55 14.16,53.55 v17.78,57.17 | C11.2 31.5,32.78 v30.48,31.77 | v20.32,38.12 16.51,34.31 13.46,34.31
LED_ERROR  (via drill 0.33)
  Top 0.305: U$45.D7 MS2.22 | v5.08,18.05 5.08,34.05 14.73,43.71 14.73,50.31 R11.2
  Bottom 0.305: v5.08,18.05 5.08,13.48 13.21,5.35 23.11,5.35 MS2.22
LED_TBD  (via drill 0.33)
  Top 0.305: U$45.D5 MS2.21 | v14.22,52.85 14.73,53.36 14.73,54.12 R23.2 | v14.22,40.15 5.59,31.51 5.59,18.56 v6.35,17.8
  Bottom 0.305: v14.22,40.15 v14.22,52.85 | v6.35,17.8 6.35,17.29 9.91,13.73 9.91,12.21 13.97,8.15 13.97,7.13 15.24,5.86 21.08,5.86 MS2.21
N$1
  Top 0.305: U3.3 70.62,15.38 71.16,14.85 71.4,14.85 71.4,12.11 70.01,12.11 U1.3 | R16.1 R3.P$1 | R13.1 R5.P$1
  Bottom 0.305: U1.3 63.25,16.53 R5.P$1 R3.P$1
N$2
  Top 0.305: R12.1 12.95,57.93 12.95,59.45 12.7,59.71 D2.A
N$3
  Top 0.305: R23.1 12.95,54.12 12.95,55.64 12.7,55.9 D1.A
N$5
  Top 0.305: U3.5 65.42,17.31 66.88,17.31 67.59,18.02 67.59,19.15 68.37,19.93 69.55,19.93 70.92,18.56 U1.5 | R15.1 R6.P$1 R4.P$1 R14.1
  Bottom 0.305: R4.P$1 60.8,10.18 61.72,9.26 71.41,9.26 72.75,10.6 72.75,11.4 71.37,12.77 U1.5
N$6
  Top 0.305: R18.1 R9.P$1 R7.P$1 R17.1 | U4.3 42.38,62.15 42.07,62.15 41.91,62.31 41.91,64.61 42.14,64.84 42.52,64.84 43.75,66.06 U2.3
  Bottom 0.305: U2.3 46.99,68.6 R9.P$1
N$8  (via drill 0.35)
  Top 0.305: R20.1 R10.P$1 | R19.1 R8.P$1 R10.P$1 | U2.5 R10.P$1 | v47,60.72 48.14,60.72 U4.5
  Bottom 0.305: U2.5 42.59,58.44 43.81,59.66 45.41,59.66 46.48,60.72 v47,60.72
N$9
  Bottom 0.305: SP2.2 28.96,38.63 25.91,35.58 20.07,35.58 18.03,33.55 18.03,32.78 18.29,32.53 18.16,32.53 Q2.3
N$10
  Top 0.305: R24.1 19.05,33.8 19.43,33.42 | 19.56,33.29 19.43,33.42 | Q2.2 19.3,33.29 19.43,33.42
N$11
  Top 0.305: R11.1 12.95,50.31 12.95,51.83 12.7,52.09 D4.A
N$12
  Top 0.305: D2.C 16.94,59.71 16.94,59.52 17.21,59.25 17.27,59.31 SJ1.2
PWM_BUZZER  (via drill 0.33)
  Top 0.305: U$45.D9 MS2.23 26.16,5.86 12.7,5.86 9.91,8.65 9.91,17.04 10.67,17.8 12.19,17.8 12.95,18.56 12.95,22.12 v10.67,24.4 | v10.67,38.63 15.75,43.71 19.05,43.71 R24.2
  Bottom 0.305: v10.67,24.4 v10.67,38.63
ROTARY_A
  Top 0.305: MS2.20 U$45.TX 21.59,13.99 R27.2
  Bottom 0.305: S5.A 12.45,32.53 11.18,31.26 11.18,24.91 17.78,18.31 U$45.TX
ROTARY_B
  Top 0.305: MS2.19 U$45.RX 17.78,12.72 R26.1
  Bottom 0.305: S5.B 7.37,32.53 9.65,30.24 9.65,17.8 15.24,12.21 U$45.RX
ROTARY_SWITCH
  Top 0.305: 35.31,9.92 MS2.25 | 35.31,9.92 28.45,16.78 25.4,16.78 R28.1 25.4,17.04 24.64,17.8 20.57,17.8 18.8,19.58 18.29,19.58 12.19,25.67 10.41,25.67 7.37,28.72 S5.SW+ | 35.31,9.92 U$45.D11
S_OUT  (via drill 0.35)
  Top 0.305: MS2.8 U$45.A3 34.29,21.61 54.61,21.61 59.06,26.05 | 59.06,26.05 64.01,31.01 U$2.4 64.01,38.88 v62.23,40.66 | 59.06,26.05 62.79,26.05 65.33,23.51 65.33,20.36 65.66,20.03 67.26,20.03 v67.28,20.01 | U3.2 69.72,14.11 68.58,15.26 | 68.58,15.26 68.58,18.31 U1.6 | U3.6 65.35,14.8 65.59,14.8 66.04,14.35 66.04,11.19 U1.2 68.58,13.23 68.58,15.26
  Bottom 0.305: v62.23,40.66 58.42,44.47 C3.1 | U1.6 67.38,20.01 v67.28,20.01
SCL  (via drill 0.35)
  Top 0.203: v33.02,39.39 36.96,39.39 U$4.3
  Top 0.305: MS2.18 15.24,8.15 11.43,11.96 R2.P$1 R22.1 11.43,17.04 12.19,17.04 13.46,18.31 13.46,22.62 10.92,25.16 10.16,25.16 6.1,29.23 6.1,31.26 6.86,32.02 v15.49,32.02 | v29.21,40.66 31.75,40.66 v33.02,39.39
  Bottom 0.203: U5.2 32.09,48.69 31.49,48.08 31.49,40.92 v33.02,39.39
  Bottom 0.305: U$45.SCL 22.86,9.42 21.59,8.15 21.59,7.13 20.83,6.37 16.51,6.37 MS2.18 | U$1.SCK 30.23,70.63 30.23,50.56 32,48.79 U5.2 | v15.49,32.02 20.32,36.85 24.13,36.85 27.94,40.66 v29.21,40.66
SDA  (via drill 0.35)
  Top 0.203: U$4.4 36.96,40.66 34.29,40.66 33.02,41.93 33.02,45.74 34.29,47.01 35.56,47.01 v35.56,47.26
  Top 0.305: R1.P$1 R21.1 7.62,17.04 5.08,17.04 4.32,17.8 4.32,34.05 5.33,35.07 5.33,54.63 11.68,60.98 22.35,60.98 32,70.63 32.51,70.63 U$1.SDA | U$45.SDA 20.32,9.42 21.59,8.15 21.59,7.13 20.83,6.37 13.97,6.37 MS2.17
  Bottom 0.203: v35.56,47.26 35.56,48.28 35.06,48.78 34.29,48.78 U5.3
  Bottom 0.305: U$1.SDA 32.77,70.63 32.77,50.31 34.29,48.79 34.29,48.78 | MS2.17 12.7,8.65 7.62,13.73 R1.P$1
SWITCH1
  Top 0.305: U$45.D10 MS2.24
  Bottom 0.305: 43.69,46.75 43.69,47.01 | 43.69,47.01 43.69,49.04 S3.1 | U$45.D10 31.5,11.7 26.92,11.7 13.72,24.91 13.72,25.93 13.97,26.18 13.97,28.47 14.74,29.23 20.7,29.23 21.97,30.5 27.43,30.5 38.81,41.88 39.03,41.88 39.8,42.65 39.8,43.12 43.69,47.01
USB  (via drill 0.35)
  Top 0.305: MS2.26 38.1,5.1 41.91,5.1 42.67,5.86 42.67,9.67 U$45.USB | v49.91,30.09 49.91,30.98 JP1.2
  Bottom 0.305: U$45.USB 43.18,16.53 47.65,21 47.65,22.73 49.55,24.64 49.55,29.46 | 49.51,29.74 49.51,29.41 49.55,29.46 | 49.55,29.46 50.01,29.91 50.01,29.99 v49.91,30.09
VBAT  (via drill 0.35)
  Top 0.305: v52.07,30.27 JP2.2
  Bottom 0.305: MS2.28 45.72,7.64 46.99,8.91 46.99,18.76 48.46,20.23 48.46,22.65 52.07,26.26 v52.07,30.27
VIN  (via drill 0.33)
  Top 0.305: JP2.1 51.97,32.17 50.8,32.17 | 50.8,32.17 JP1.1 49.53,34.31 49.05,34.79 3V_REGULATOR.3 51.51,35.02 54.61,38.12 C9.1 | R12.2 15.49,57.93 22.61,50.82 22.61,42.94 | 22.61,42.94 22.61,38.63 SP2.1 | U$40.1 1.4,23.77 3.56,25.93 v3.56,30.5 | v6.6,33.55 16,42.94 22.61,42.94 | v50.8,32.28 50.8,32.17
  Bottom 0.305: v6.6,33.55 v3.56,30.5 | v50.8,32.28 51.31,32.28 52.83,30.75 52.83,22.88 49.78,19.83 49.78,9.67 44.96,4.84 12.95,4.84 1.4,16.4 U$40.1

### Text on the board
tPlace: LM358 | POWER | MP3V5004DP | ERROR | USER | A3V3 REG | ROTARY / ENCODER | A3V3 | MP3V5004G | BUZZ | AGND | 3V | GND | VIN | Dual Footprint Micro-Controller / Adafruit Feather / Adafruit Itsy | I2C | LM358 | Project Flow Sensor w/ GUI and User Input / 3/21/2020 V.0
bPlace: GND | 3V | SCL | SDA | SHTC3 | HIH8120 | A3V3 | S_O | D_O | 3V | A5 | A4 | A2 | A1 | AGND | GND | AREF | 3V | GND | 2 | MISO | MOSI | SCK | A5 | A4 | S_OUT | A2 | A1 | D_OUT | 3V | VIN | AREF | ENCOD_B | ENCOD_A | SDA | SCL | LED_TB | LED_E | BUZZ | U_SW | R_SW | D12 | D13 | USB | GND | SDA | SCL | USB | LED_E | BUZZ | U_SW | R_SW | VBAT | ENCO_B | ENCO_A | LED_TB